# Altium schematic sheet SCH_03_Instrumentation_Amplifier.SchDoc
size A4; SheetNumber: 8; SheetTotal: 14; SPICEModelCacheUCDMULDR: <root> / <DocumentId>UCDMULDR</DocumentId> / </root>
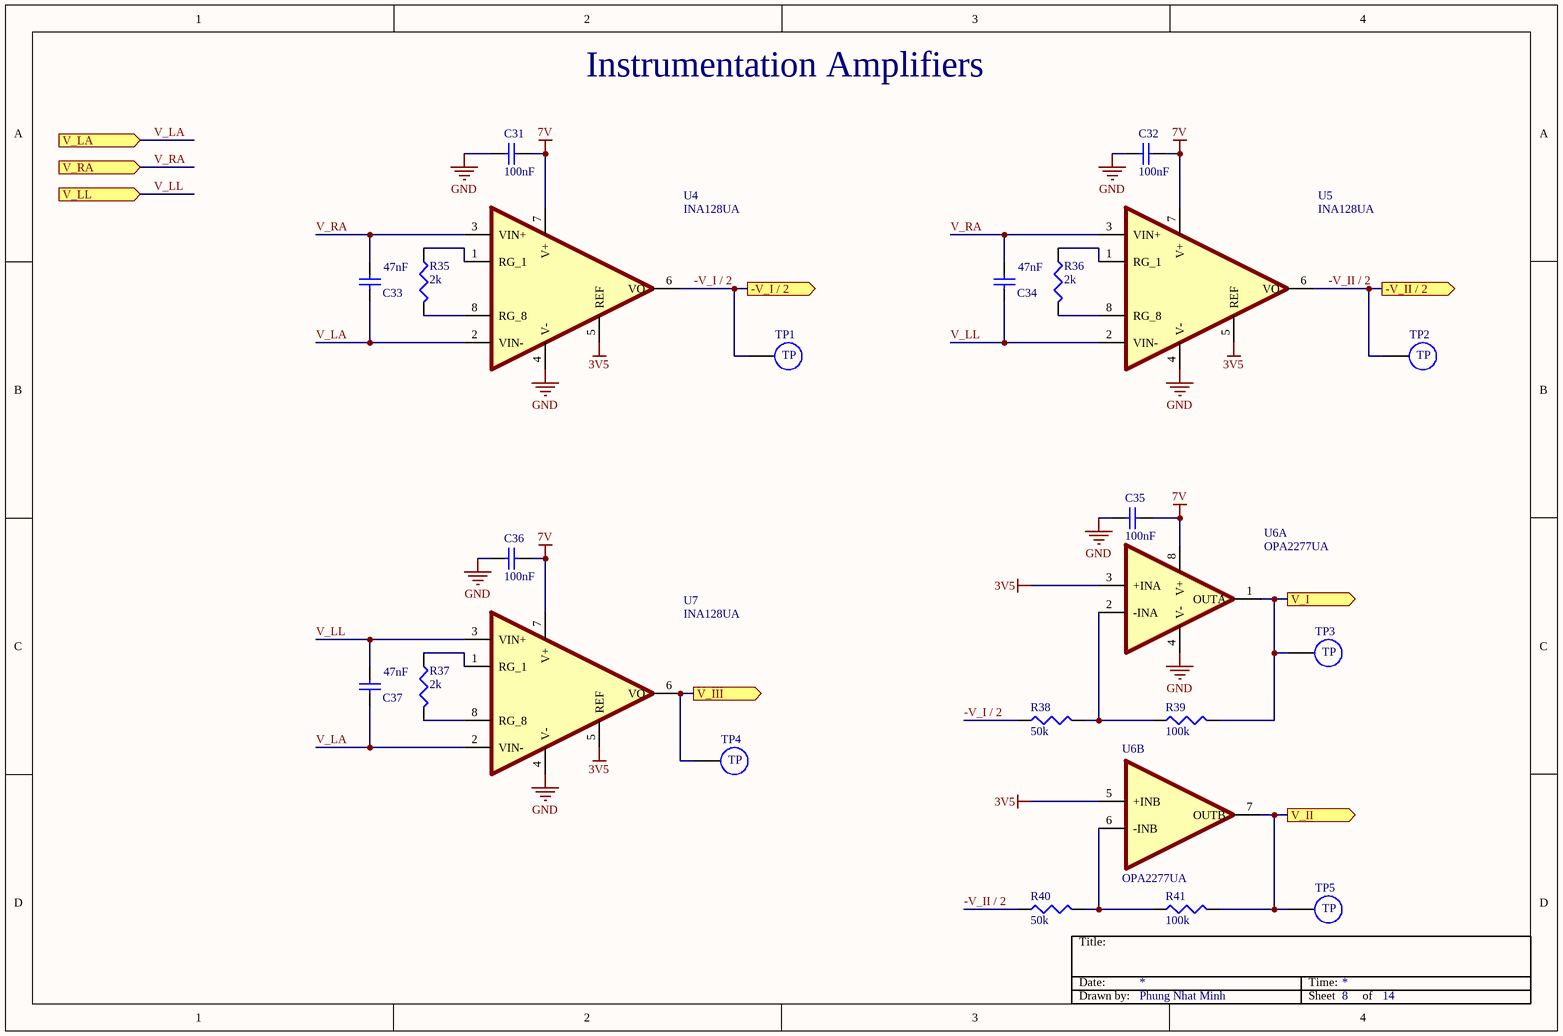
[diagram p0: SCH_03_Instrumentation_Amplifier.SchDoc]

## Parts
C31  100nF  [WCAP-CSGP_0603_L1.6W0.8H0.8_Reflow]
C32  100nF  [WCAP-CSGP_0603_L1.6W0.8H0.8_Reflow]
C33  47nF  [WCAP-CSGP_0603_L1.6W0.8H0.8_Reflow]
C34  47nF  [WCAP-CSGP_0603_L1.6W0.8H0.8_Reflow]
C35  100nF  [WCAP-CSGP_0603_L1.6W0.8H0.8_Reflow]
C36  100nF  [WCAP-CSGP_0603_L1.6W0.8H0.8_Reflow]
C37  47nF  [WCAP-CSGP_0603_L1.6W0.8H0.8_Reflow]
R35  2k  [WRIS-PSMB_0603_L1.6W0.8H0.35]
R36  2k  [WRIS-PSMB_0603_L1.6W0.8H0.35]
R37  2k  [WRIS-PSMB_0603_L1.6W0.8H0.35]
R38  50k  [WRIS-PSMB_0603_L1.6W0.8H0.35]
R39  100k  [WRIS-PSMB_0603_L1.6W0.8H0.35]
R40  50k  [WRIS-PSMB_0603_L1.6W0.8H0.35]
R41  100k  [WRIS-PSMB_0603_L1.6W0.8H0.35]
TP1  Pad_Test_Point  [Pad_Test_Point]  (value not drawn)
TP2  Pad_Test_Point  [Pad_Test_Point]  (value not drawn)
TP3  Pad_Test_Point  [Pad_Test_Point]  (value not drawn)
TP4  Pad_Test_Point  [Pad_Test_Point]  (value not drawn)
TP5  Pad_Test_Point  [Pad_Test_Point]  (value not drawn)
U4  INA128UA  [SOIC127P599X175-8N]
U5  INA128UA  [SOIC127P599X175-8N]
U6  OPA2277UA  [SOIC127P599X175-8N]  (parts A,B of 2)
U7  INA128UA  [SOIC127P599X175-8N]

## Ports
-V_I / 2 (out, see Schematic_Top[2B], SCH_06_Analog_Mux[2B]), -V_II / 2 (out, see Schematic_Top[2B], SCH_06_Analog_Mux[2C]), V_I (out, see Schematic_Top[2A], SCH_06_Analog_Mux[2B]), V_II (out, see Schematic_Top[2B], SCH_06_Analog_Mux[2C]), V_III (out, see Schematic_Top[2B], SCH_06_Analog_Mux[2C]), V_LA (in, see Schematic_Top[1A], SCH_02_Electrodes[2A], SCH_05_WCT_RLD[1A]), V_LL (in, see Schematic_Top[1B], SCH_02_Electrodes[2B], SCH_05_WCT_RLD[1B]), V_RA (in, see Schematic_Top[1B], SCH_02_Electrodes[2A], SCH_05_WCT_RLD[1B])

## Nets
3V5: U4.5(REF) U5.5(REF) U6.3(+INA) U6.5(+INB) U7.5(REF)
7V: C31.1 C32.1 C35.1 C36.1 U4.7(V+) U5.7(V+) U6.8(V+) U7.7(V+)
GND: C31.2 C32.2 C35.2 C36.2 U4.4(V-) U5.4(V-) U6.4(V-) U7.4(V-)
-V_I / 2: R38.1 TP1.1 U4.6(VO) ; port -V_I / 2
-V_II / 2: R40.1 TP2.1 U5.6(VO) ; port -V_II / 2
V_I: R39.2 TP3.1 U6.1(OUTA) ; port V_I
V_II: R41.2 TP5.1 U6.7(OUTB) ; port V_II
V_III: TP4.1 U7.6(VO) ; port V_III
V_LA: C33.1 C37.1 U4.2(VIN-) U7.2(VIN-) ; port V_LA
V_LL: C34.1 C37.2 U5.2(VIN-) U7.3(VIN+) ; port V_LL
V_RA: C33.2 C34.2 U4.3(VIN+) U5.3(VIN+) ; port V_RA
NetR35_1: R35.1 U4.1(RG_1)
NetR35_2: R35.2 U4.8(RG_8)
NetR36_1: R36.1 U5.1(RG_1)
NetR36_2: R36.2 U5.8(RG_8)
NetR37_1: R37.1 U7.1(RG_1)
NetR37_2: R37.2 U7.8(RG_8)
NetR38_2: R38.2 R39.1 U6.2(-INA)
NetR40_2: R40.2 R41.1 U6.6(-INB)

## Notes on the sheet
- Instrumentation Amplifiers
- Title:
- Date:
- Time:
- Drawn by:
- Phung Nhat Minh
- Sheet
- of
- (in symbol Pad_Test_Point) TP

## Library data of the parts
C31 C32 C35 C36 = 885012206095: WCAP-CSGP Multilayer Ceramic Chip Capacitor, General Purpose, size 0603, X7R, 100nF, 50VDC; Manufacturer: Wurth Elektronik; Case/Size Code: 0603; Capacitance Tolerance: +/-10%; Dissipation Factor: 3%; Insulation Resistance: 5GOhm; Rated Voltage (DC): 50V; Technical Reference: X7R0603104K050DFCT10000; Manufacturer Part Number: 885012206095; Category: Multilayer Ceramic Chip Capacitors; Match Code: WCAP-CSGP; ComponentLink1Description: Website Link; ComponentLink1URL: https://www.we-online.com/redexpert/article/885012206095?ad; ComponentLink2Description: Datasheet Link; ComponentLink2URL: https://www.we-online.com/redexpert/spec/885012206095?ad; Mount: Surface Mount; Operating Temperature Max: 125°C; Operating Temperature Min: -55°C; Packaging: Tape and Reel; Length: 1.6mm; Width: 0.8mm; Height: 0.8mm; Capacitance: 100nF; Ceramic Type: X7R
C33 C34 C37 = 885012206093: WCAP-CSGP Multilayer Ceramic Chip Capacitor, General Purpose, size 0603, X7R, 47nF, 50VDC; Manufacturer: Wurth Elektronik; Case/Size Code: 0603; Capacitance Tolerance: +/-10%; Dissipation Factor: 3%; Insulation Resistance: 10GOhm; Rated Voltage (DC): 50V; Technical Reference: X7R0603473K050DFCT10000; Manufacturer Part Number: 885012206093; Category: Multilayer Ceramic Chip Capacitors; Match Code: WCAP-CSGP; ComponentLink1Description: Website Link; ComponentLink1URL: https://www.we-online.com/redexpert/article/885012206093?ad; ComponentLink2Description: Datasheet Link; ComponentLink2URL: https://www.we-online.com/redexpert/spec/885012206093?ad; Mount: Surface Mount; Operating Temperature Max: 125°C; Operating Temperature Min: -55°C; Packaging: Tape and Reel; Length: 1.6mm; Width: 0.8mm; Height: 0.8mm; Capacitance: 47nF; Ceramic Type: X7R
R35-R41 = 580060716001: WRIS-PSMB Metal Plate Resistor, SMT, size 0603, 0.33W, 5mΩ, +/-1%; Manufacturer: Wurth Elektronik; Case/Size Code: 0603; Rated Current: 8.12A; Technical Reference: MB0603R005F103KAATP0000; Temperature Coefficient of Resistance: +/-100ppm/°C; Manufacturer Part Number: 580060716001; Category: Metal Plate Resistors; Match Code: WRIS-PSMB; ComponentLink1Description: Website Link; ComponentLink1URL: https://www.we-online.com/redexpert/article/580060716001?ad; ComponentLink2Description: Datasheet Link; ComponentLink2URL: https://www.we-online.com/redexpert/spec/580060716001?ad; Mount: Surface Mount; Operating Temperature Max: 155°C; Operating Temperature Min: -55°C; Packaging: Tape and Reel; Length: 1.6mm; Width: 0.8mm; Height: 0.35mm; Rated Power: 0.33W; Resistance: 5mΩ; Resistance Tolerance: +/-1%
U4 U5 U7 = INA128UA: Precision, 130-dB CMRR, 700-A, Low-Power, Instrumentation Amplifier 8-SOIC -40 to 125; MP: INA128UA/2K5; MF: Texas Instruments; Value: *; Package: SOIC-8 Texas Instruments; Availability: Good; SnapEDA_Link: https://www.snapeda.com/parts/INA128UA/2K5/Texas%20Instruments/view-part/1191532/?ref=snap; Price: None; Purchase-URL: https://pricing.snapeda.com/search/part/INA128UA/2K5/?ref=eda
U6 = OPA2277UA: MP: OPA2227UA; Package: None; Price: None; Value: *; Availability: Unavailable